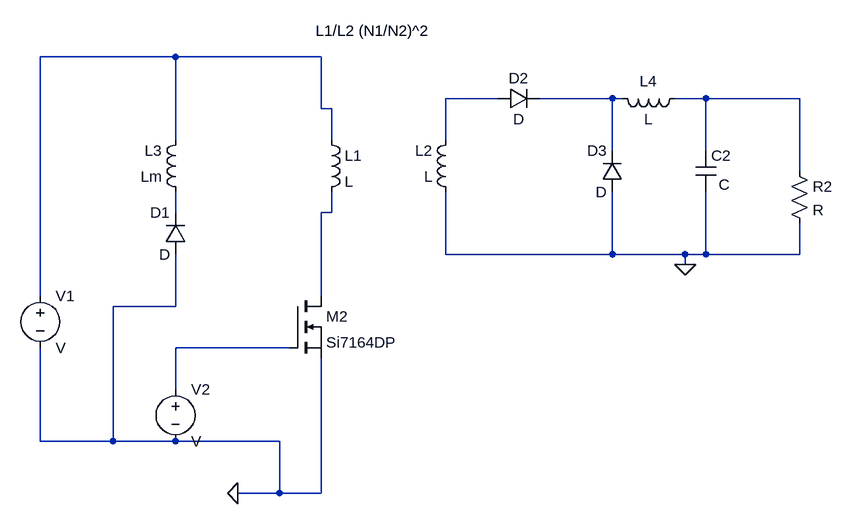
[diagram p0: schematic forward_converter_own_design.asc]
forward_converter_own_design.asc, the LTspice schematic file:
Version 4
SHEET 1 1240 680
WIRE 224 -224 16 -224
WIRE 448 -224 224 -224
WIRE 720 -160 640 -160
WIRE 896 -160 784 -160
WIRE 912 -160 896 -160
WIRE 1040 -160 992 -160
WIRE 1184 -160 1040 -160
WIRE 448 -144 448 -224
WIRE 464 -144 448 -144
WIRE 224 -96 224 -224
WIRE 464 -96 464 -144
WIRE 640 -96 640 -160
WIRE 896 -80 896 -160
WIRE 1040 -80 1040 -160
WIRE 1184 -48 1184 -160
WIRE 224 16 224 -16
WIRE 464 16 464 -16
WIRE 464 16 448 16
WIRE 640 80 640 -16
WIRE 896 80 896 -16
WIRE 896 80 640 80
WIRE 1008 80 896 80
WIRE 1040 80 1040 -16
WIRE 1040 80 1008 80
WIRE 1184 80 1184 32
WIRE 1184 80 1040 80
WIRE 1008 96 1008 80
WIRE 16 144 16 -224
WIRE 448 144 448 16
WIRE 224 160 224 80
WIRE 224 160 128 160
WIRE 400 224 224 224
WIRE 224 288 224 224
WIRE 16 368 16 224
WIRE 128 368 128 160
WIRE 128 368 16 368
WIRE 224 368 128 368
WIRE 384 368 224 368
WIRE 384 448 384 368
WIRE 384 448 320 448
WIRE 448 448 448 240
WIRE 448 448 384 448
FLAG 1008 96 0
FLAG 320 448 0
SYMBOL voltage 16 128 R0
SYMATTR InstName V1
SYMBOL nmos 400 144 R0
SYMATTR InstName M2
SYMATTR Value Si7164DP
SYMBOL voltage 224 272 R0
SYMATTR InstName V2
SYMBOL ind 448 -112 R0
SYMATTR InstName L1
SYMBOL ind 656 0 R180
WINDOW 0 36 80 Left 2
WINDOW 3 36 40 Left 2
SYMATTR InstName L2
SYMBOL ind 240 0 R180
WINDOW 0 36 80 Left 2
WINDOW 3 36 40 Left 2
SYMATTR InstName L3
SYMATTR Value Lm
SYMBOL diode 720 -144 R270
WINDOW 0 32 32 VTop 2
WINDOW 3 0 32 VBottom 2
SYMATTR InstName D2
SYMBOL diode 912 -16 R180
WINDOW 0 24 64 Left 2
WINDOW 3 24 0 Left 2
SYMATTR InstName D3
SYMBOL ind 1008 -176 R90
WINDOW 0 5 56 VBottom 2
WINDOW 3 32 56 VTop 2
SYMATTR InstName L4
SYMBOL res 1168 -64 R0
SYMATTR InstName R2
SYMBOL cap 1024 -80 R0
WINDOW 3 36 53 Left 2
SYMATTR InstName C2
SYMBOL diode 240 80 R180
WINDOW 0 24 64 Left 2
WINDOW 3 24 0 Left 2
SYMATTR InstName D1
TEXT 440 -264 Left 2 !L1/L2 (N1/N2)^2

The netlist it stands for:
* forward_converter_own_design.asc
V1 N001 0 V
M2 N006 N007 0 0 Si7164DP
V2 N007 0 V
L1 N001 N006 L
L2 0 N002 L
L3 N005 N001 Lm
D2 N002 N003 D
D3 0 N003 D
L4 N004 N003 L
R2 N004 0 R
C2 N004 0 C
D1 0 N005 D
.model D D
.lib standard.dio
.model NMOS NMOS
.model PMOS PMOS
.lib standard.mos
L1/L2 (N1/N2)^2
.backanno
.end